# Altium schematic sheet SCH.schdoc
size 270 x 126 mm
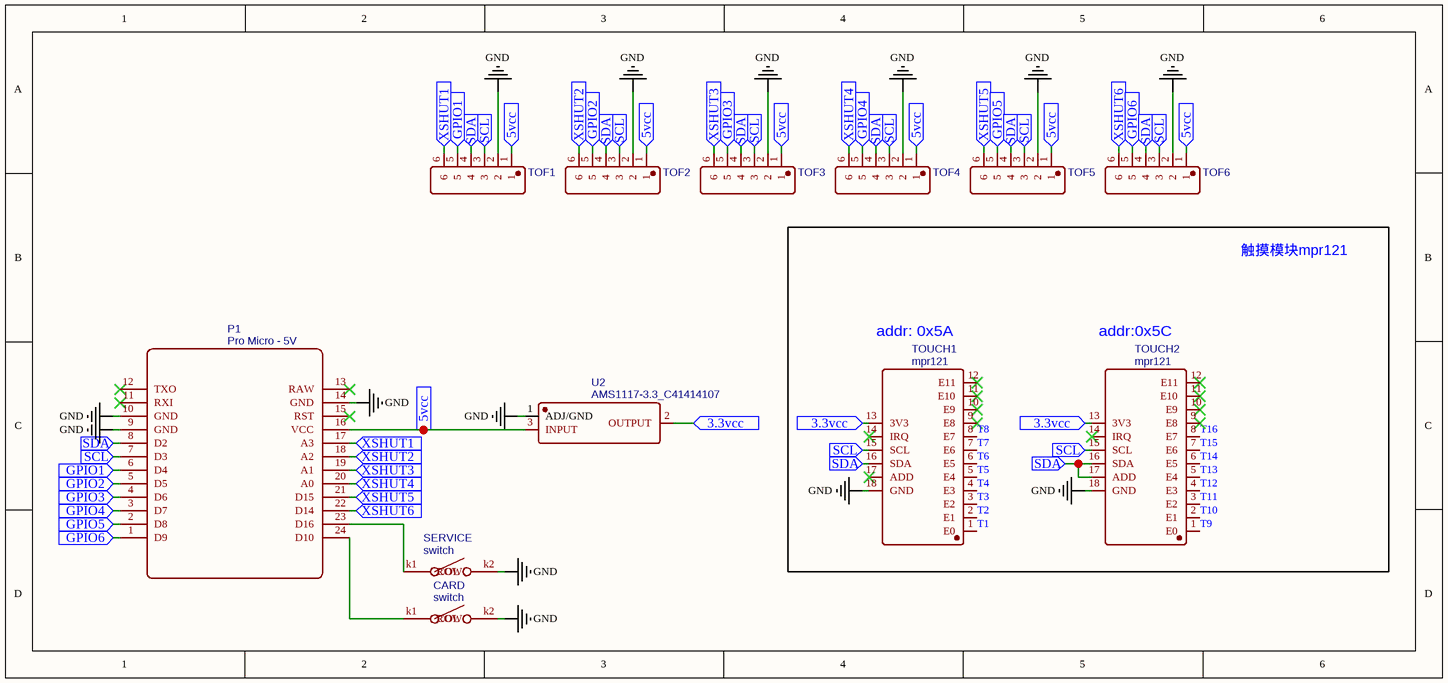
[diagram p0: SCH.schdoc]

## Parts
CARD  switch  [MX_CONTACT_POGOPIN_M1.4_焊接]
P1  Pro Micro - 5V  [PRO MICRO - 5V]
SERVICE  switch  [MX_CONTACT_POGOPIN_M1.4_焊接]
TOF1  双塑单排排针6PIN2.54间距  [HDR-TH_6P-P2.54-V-M-A-1]  (value not drawn)
TOF2  双塑单排排针6PIN2.54间距  [HDR-TH_6P-P2.54-V-M-A-1]  (value not drawn)
TOF3  双塑单排排针6PIN2.54间距  [HDR-TH_6P-P2.54-V-M-A-1]  (value not drawn)
TOF4  双塑单排排针6PIN2.54间距  [HDR-TH_6P-P2.54-V-M-A-1]  (value not drawn)
TOF5  双塑单排排针6PIN2.54间距  [HDR-TH_6P-P2.54-V-M-A-1]  (value not drawn)
TOF6  双塑单排排针6PIN2.54间距  [HDR-TH_6P-P2.54-V-M-A-1]  (value not drawn)
TOUCH1  mpr121  [MPR121]
TOUCH2  mpr121  [MPR121]
U2  AMS1117-3.3_C41414107  [TO-252-2_L6.6-W5.6-P2.3-LS9.7]

## Ports
3.3vcc (in), 5vcc (in), GPIO1 (in), GPIO2 (in), GPIO3 (in), GPIO4 (in), GPIO5 (in), GPIO6 (in), SCL (in), SDA (in), XSHUT1 (in), XSHUT2 (in), XSHUT3 (in), XSHUT4 (in), XSHUT5 (in), XSHUT6 (in)

## Nets
GND: CARD.k2(ROW) P1.9(GND) P1.10(GND) P1.14(GND) SERVICE.k2(ROW) TOF1.2 TOF2.2 TOF3.2 TOF4.2 TOF5.2 TOF6.2 TOUCH1.18(GND) TOUCH2.18(GND) U2.1(ADJ/GND)
3.3vcc: TOUCH1.13(3V3) TOUCH2.13(3V3) U2.2(OUTPUT) ; port 3.3vcc
5vcc: P1.16(VCC) TOF1.1 TOF2.1 TOF3.1 TOF4.1 TOF5.1 TOF6.1 U2.3(INPUT) ; port 5vcc
GPIO1: P1.6(D4) TOF1.5 ; port GPIO1
GPIO2: P1.5(D5) TOF2.5 ; port GPIO2
GPIO3: P1.4(D6) TOF3.5 ; port GPIO3
GPIO4: P1.3(D7) TOF4.5 ; port GPIO4
GPIO5: P1.2(D8) TOF5.5 ; port GPIO5
GPIO6: P1.1(D9) TOF6.5 ; port GPIO6
SCL: P1.7(D3) TOF1.3 TOF2.3 TOF3.3 TOF4.3 TOF5.3 TOF6.3 TOUCH1.15(SCL) TOUCH2.15(SCL) ; port SCL
SDA: P1.8(D2) TOF1.4 TOF2.4 TOF3.4 TOF4.4 TOF5.4 TOF6.4 TOUCH1.16(SDA) TOUCH2.16(SDA) TOUCH2.17(ADD) ; port SDA
T1: TOUCH1.1(E0)
T2: TOUCH1.2(E1)
T3: TOUCH1.3(E2)
T4: TOUCH1.4(E3)
T5: TOUCH1.5(E4)
T6: TOUCH1.6(E5)
T7: TOUCH1.7(E6)
T8: TOUCH1.8(E7)
T9: TOUCH2.1(E0)
T10: TOUCH2.2(E1)
T11: TOUCH2.3(E2)
T12: TOUCH2.4(E3)
T13: TOUCH2.5(E4)
T14: TOUCH2.6(E5)
T15: TOUCH2.7(E6)
T16: TOUCH2.8(E7)
XSHUT1: P1.17(A3) TOF1.6 ; port XSHUT1
XSHUT2: P1.18(A2) TOF2.6 ; port XSHUT2
XSHUT3: P1.19(A1) TOF3.6 ; port XSHUT3
XSHUT4: P1.20(A0) TOF4.6 ; port XSHUT4
XSHUT5: P1.21(D15) TOF5.6 ; port XSHUT5
XSHUT6: P1.22(D14) TOF6.6 ; port XSHUT6
NetCARD_k1: CARD.k1(COL) P1.24(D10)
NetP1_23: P1.23(D16) SERVICE.k1(COL)

Not connected (* = marked no-connect by the designer): P1 11(RXI)* 12(TXO)* 13(RAW)* 15(RST)*; TOUCH1 9(E8)* 10(E9)* 11(E10)* 12(E11)* 14(IRQ)* 17(ADD)*; TOUCH2 9(E8)* 10(E9)* 11(E10)* 12(E11)* 14(IRQ)*

## Notes on the sheet
- 触摸模块mpr121
- (near TOUCH1) addr: 0x5A
- (near TOUCH2) addr:0x5C

## Library data of the parts
CARD SERVICE = switch: Contributor: wnyr; spicePre: K; spiceSymbolName: 凯华热插拔 焊接 COPY22
P1 = Pro Micro - 5V: sourceId: 1T5FDZYC8; timeStamp: 1460375612; spicePre: P; spiceSymbolName: Pro Micro - 5V
TOF1-TOF6 = 双塑单排排针6PIN2.54间距: Manufacturer: null; Contributor: lcsc; Supplier: LCSC; Supplier Part: C9900029194; Manufacturer Part: 双塑单排排针6PIN2.54间距; JLCPCB Part Class: Extended Part; spicePre: U; spiceSymbolName: 双塑单排排针6PIN2.54间距
TOUCH1 TOUCH2 = mpr121: Contributor: goodwood; spicePre: U; spiceSymbolName: mpr121
U2 = AMS1117-3.3_C41414107: Manufacturer: YONGYUTAI(永裕泰); Contributor: lcsc; Supplier: LCSC; Supplier Part: C41414107; Manufacturer Part: AMS1117-3.3; JLCPCB Part Class: Extended Part; spicePre: U; spiceSymbolName: AMS1117-3.3_C41414107